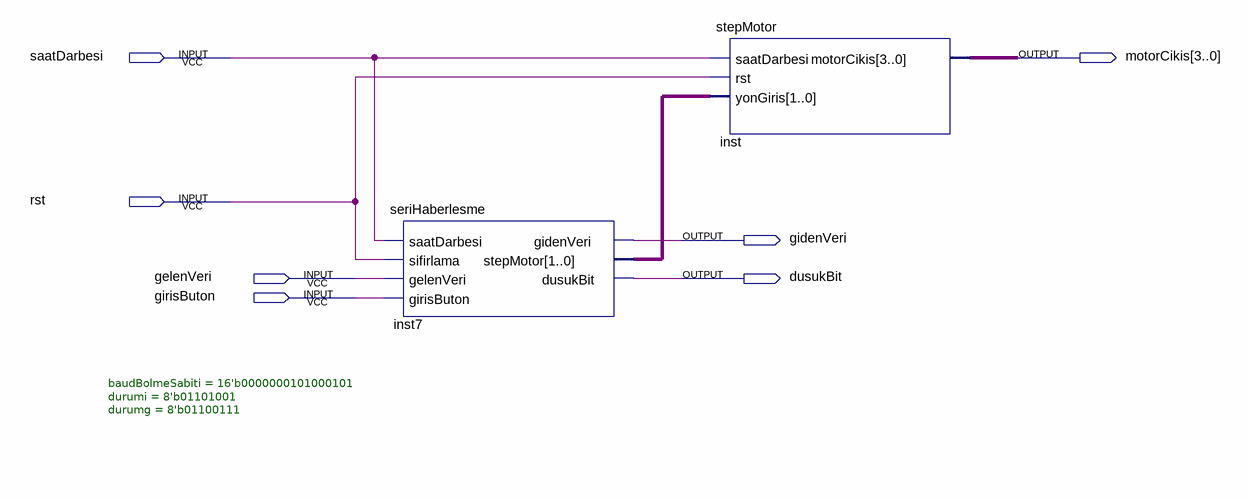
[diagram p0: schematic sheet]
// Quartus schematic Block1.bdf as structural Verilog: 2 symbols, 7 pins
module Block1 (
  input  saatDarbesi,
  input  rst,
  input  gelenVeri,
  input  girisButon,
  output [3:0] motorCikis,
  output gidenVeri,
  output dusukBit
);

  wire [1:0] inst7_stepmotor;

  seriHaberlesme #(.baudBolmeSabiti(16'b0000000101000101), .durumi(8'b01101001), .durumg(8'b01100111)) inst7 (
    .saatDarbesi(saatDarbesi), .sifirlama(rst), .gelenVeri(gelenVeri), .girisButon(girisButon),
    .gidenVeri(gidenVeri), .stepMotor(inst7_stepmotor), .dusukBit(dusukBit));
  stepMotor inst (.saatDarbesi(saatDarbesi), .rst(rst), .yonGiris(inst7_stepmotor), .motorCikis(motorCikis));
endmodule
